# Altium schematic sheet ShutdownLoop.SchDoc: QUTMS Shutdown V2.1 - ShutdownLoop
size A4; Organization: QUT Motorsport; Address1: O-120; Address2: O Block; Address3: QUT Gardnes Point; Address4: Brisbane, 4000; DocumentNumber: 2; Revision: 9; SheetNumber: 2; SheetTotal: 7
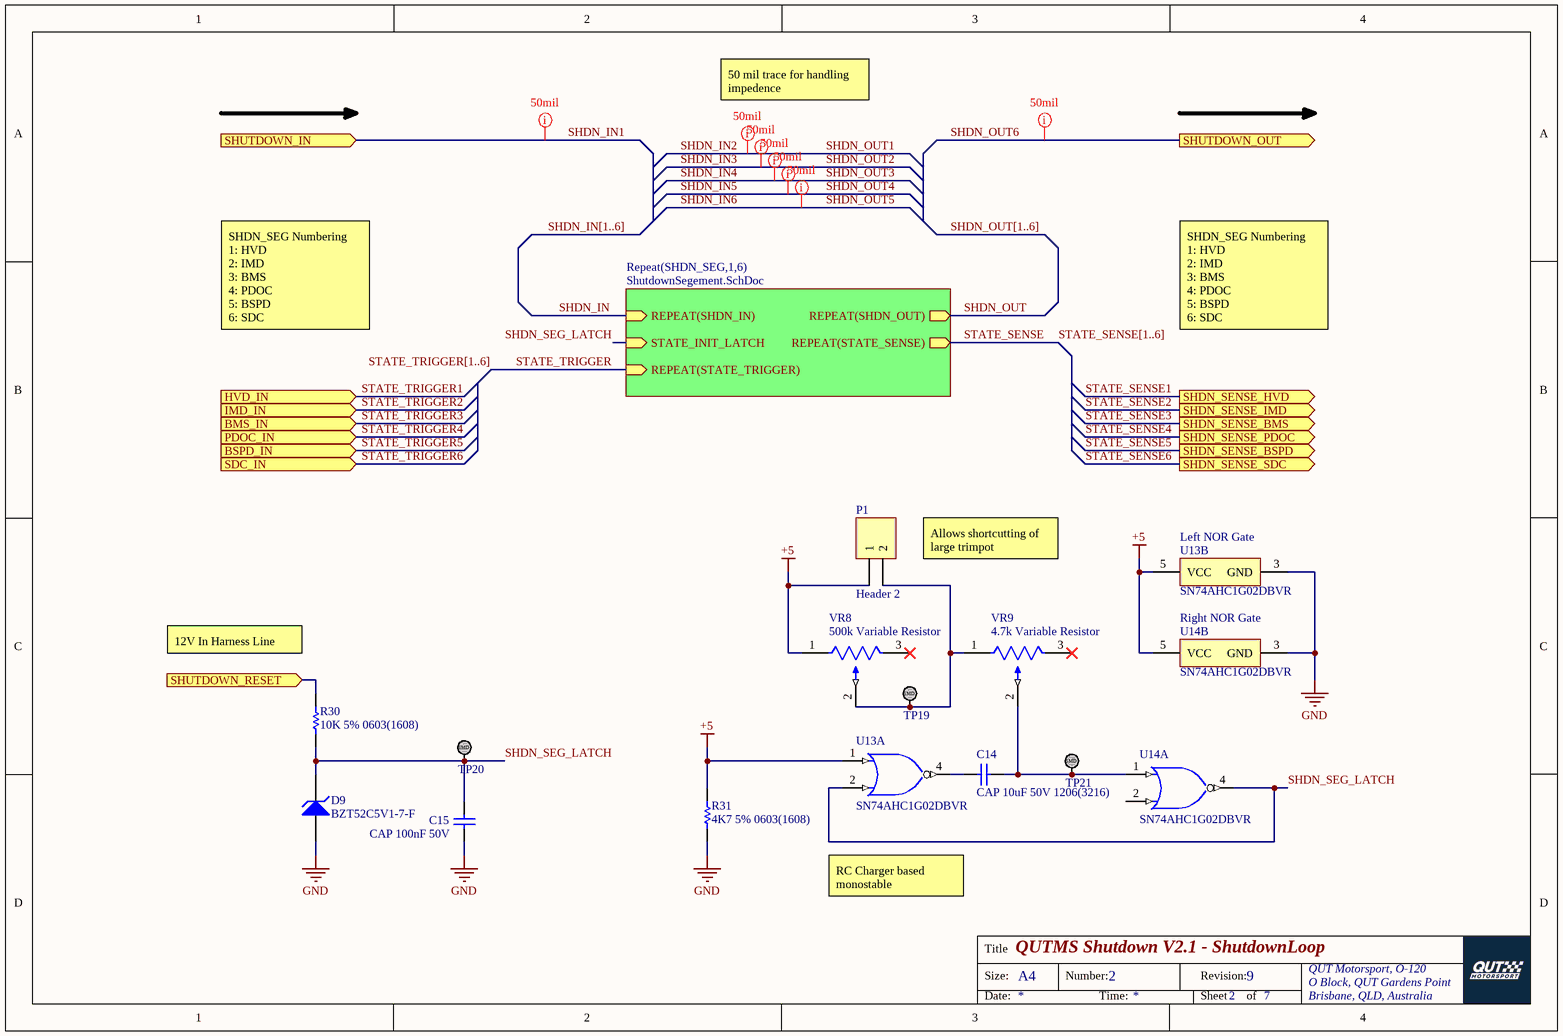
[diagram p0: ShutdownLoop.SchDoc]

## Parts
C14  CAP 10uF 50V 1206(3216)  [CAPC1206(3216)190_M]
C15  CAP 100nF 50V  [CAPC0603(1608)100_L]
D9  BZT52C5V1-7-F  [DIOD-SOD123_V]
P1  Header 2  [HDR1X2]
R30  10K 5% 0603(1608)  [RESC0603(1608)_N]
R31  4K7 5% 0603(1608)  [RESC0603(1608)_N]
TP19  TestPoint_SMD  [TestPointSMD]  (value not drawn)
TP20  TestPoint_SMD  [TestPointSMD]  (value not drawn)
TP21  TestPoint_SMD  [TestPointSMD]  (value not drawn)
U13  SN74AHC1G02DBVR  [DBV0005A_L]  (parts A,B of 2)
U14  SN74AHC1G02DBVR  [DBV0005A_L]  (parts A,B of 2)
VR8  500k Variable Resistor  [VG039NCHXTB472]
VR9  4.7k Variable Resistor  [VG039NCHXTB472]

## Sub-sheets
Repeat(SHDN_SEG,1,6) = ShutdownSegement.SchDoc: REPEAT(SHDN_OUT) (out), REPEAT(SHDN_IN) (in), STATE_INIT_LATCH (in), REPEAT(STATE_TRIGGER) (in), REPEAT(STATE_SENSE) (out)

## Ports
BMS_IN (in), BSPD_IN (in), HVD_IN (in), IMD_IN (in), PDOC_IN (in), SDC_IN (in), SHDN_SENSE_BMS (out), SHDN_SENSE_BSPD (out), SHDN_SENSE_HVD (out), SHDN_SENSE_IMD (out), SHDN_SENSE_PDOC (out), SHDN_SENSE_SDC (out), SHUTDOWN_IN (in), SHUTDOWN_OUT (out), SHUTDOWN_RESET (in)

## Nets
+5: P1.1 R31.2 U13.1(A) U13.5(VCC) U14.5(VCC) VR8.1
GND: C15.2 D9.1(A) R31.1 U13.3(GND) U14.3(GND)
SHDN_IN: sheet Repeat(SHDN_SEG,1,6)/REPEAT(SHDN_IN)
SHDN_IN1: port SHUTDOWN_IN
SHDN_OUT: sheet Repeat(SHDN_SEG,1,6)/REPEAT(SHDN_OUT)
SHDN_OUT6: port SHUTDOWN_OUT
SHDN_SEG_LATCH: C15.1 D9.2(K) R30.2 TP20.1 U13.2(B) U14.4(Y) ; sheet Repeat(SHDN_SEG,1,6)/STATE_INIT_LATCH
SHUTDOWN_RESET: R30.1 ; port SHUTDOWN_RESET
STATE_SENSE: sheet Repeat(SHDN_SEG,1,6)/REPEAT(STATE_SENSE)
STATE_SENSE1: port SHDN_SENSE_HVD
STATE_SENSE2: port SHDN_SENSE_IMD
STATE_SENSE3: port SHDN_SENSE_BMS
STATE_SENSE4: port SHDN_SENSE_PDOC
STATE_SENSE5: port SHDN_SENSE_BSPD
STATE_SENSE6: port SHDN_SENSE_SDC
STATE_TRIGGER: sheet Repeat(SHDN_SEG,1,6)/REPEAT(STATE_TRIGGER)
STATE_TRIGGER1: port HVD_IN
STATE_TRIGGER2: port IMD_IN
STATE_TRIGGER3: port BMS_IN
STATE_TRIGGER4: port PDOC_IN
STATE_TRIGGER5: port BSPD_IN
STATE_TRIGGER6: port SDC_IN
NetC14_1: C14.1 TP21.1 U14.1(A) VR9.2
NetC14_2: C14.2 U13.4(Y)
NetP1_2: P1.2 TP19.1 VR8.2 VR9.1

Not connected (* = marked no-connect by the designer): U14 2(B); VR8 3(49)*; VR9 3(49)*

## Buses and harness runs
bus SHDN_IN[1..6]
bus SHDN_OUT[1..6]
bus STATE_SENSE[1..6]
bus STATE_TRIGGER[1..6]

## Layout directives
rule Width Constraint [Pref Width = 50mil    Min Width = 50mil    Max Width = 50mil]: SHDN_IN1, SHDN_IN2, SHDN_IN3, SHDN_IN4, SHDN_IN5, SHDN_IN6, SHDN_OUT6

## Notes on the sheet
- 50 mil trace for handling impedence
- SHDN_SEG Numbering
  1: HVD
  2: IMD
  3: BMS
  4: PDOC
  5: BSPD
  6: SDC
- (near P1) Allows shortcutting of large trimpot
- (near U13) Left NOR Gate
- 12V In Harness Line
- Right NOR Gate
- RC Charger based monostable
- Title
- Size:
- A4
- Number:
- Revision:
- QUT Motorsport, O-120
- O Block, QUT Gardens Point
- Date:
- Time:
- Sheet
- of
- Brisbane, QLD, Australia
- (in symbol TestPoint_SMD) SMD

## Library data of the parts
C14 = CMP-1037-04982-1: CAP 10uF 50V ±10% 1206 (3216 Metric) Thickness 1.9mm SMD; Case-EIA: 1206; Tolerance: Â±10%; Case-Metric: 3216; Technology: SMT; Max Thickness: 1.9 mm; Value: 10uF; Rated Voltage: 50 V
C15 = CMP-1035-02591-1: CAP 100nF 50V ±5% 0603 (1608 Metric) Thickness 1mm SMD; Tolerance: Â±5%; Case-Metric: 1608; Case-EIA: 0603; Rated Voltage: 50 V; Max Thickness: 1 mm; Technology: SMT; Value: 100nF
D9 = CMP-2000-05976-1: Surface Mount Zener Diode, 5.1 V, -65 to 150 degC, 2-Pin SMD (SOD-123), RoHS, Tape and Reel; Manufacturer: DiodesIncorporated; Unit Weight: 0.000353oz; Zz - Zener Impedance: 60Ohms; Vz - Zener Voltage: 5.1V; Pd - Power Dissipation: 500mW; Zener Current: 5mA; Ir - Reverse Current: 2uA; Voltage Temperature Coefficient: -0.75mV/C; Configuration: Single; Voltage Tolerance: 6%; Height: 1.35mm; Width: 1.7mm; Minimum Operating Temperature: -65C; Series: BZT52C5; Package Description: 2-Pin Surface Mount Device, Body 2.7 x 1.55 mm; Length: 2.85mm; Mounting Technology: SurfaceMount; Brand: DiodesIncorporated; Factory Pack Quantity: 3000; Product Category: ZenerDiodes; RoHS: True; Manufacturer URL: http://www.diodes.com/; Termination Style: SMD/SMT; Package / Case: SOD-123; Packaging: Reel; Package Reference: SOD123; Datasheet Version: Rev. 37-2, 09/2012; Maximum Operating Temperature: +150C; Datasheet URL: http://www.diodes.com/_files/datasheets/ds18004.pdf; Mounting Style: SMD/SMT
P1 = Header 2: Header, 2-Pin; LatestRevisionDate: 17-Jul-2002; LatestRevisionNote: Re-released for DXP Platform.; Publisher: Altium Limited
R30 = CMP-1012-00098-1: 10K 0.1W 5% 0603 (1608 Metric)  SMD; Case-EIA: 0603; Value: 10000.00 Ohm; Case-Metric: 1608; Technology: SMT; Tolerance: 5 %; Power: 0.1 W
R31 = CMP-1012-00090-1: 4K7 0.1W 5% 0603 (1608 Metric)  SMD; Case-Metric: 1608; Value: 4700.00 Ohm; Case-EIA: 0603; Tolerance: 5 %; Technology: SMT; Power: 0.1 W
U13 U14 = CMP-0859-00024-3: Single 2-Input Positive-NOR Gate, DBV0005A, LARGE T&R; Manufacturer: Texas Instruments; Output Drive (IOL/IOH)(Max)(mA): 50/-50; Sub-Family: NAND Gate; Gate Type: NOR; Output Type: CMOS; 3-State Output: No; Voltage(Nom)(V): 3.3,5; tpd @ Nom Voltage(Max)(ns): 11.4,7.5; Bits(#): 1; VCC(Max)(V): 5.5; ICC @ Nom Voltage(Max)(mA): 0.01; VCC(Min)(V): 2; Technology Family: AHC; Rating: Catalog; Logic: True; F @ Nom Voltage(Max)(Mhz): 75; DatasheetVersion: SCLS342M; Input Type: CMOS; Operating Temperature Range(C): -40 to 125,-40 to 85; Generic Part Number: SN74AHC1G02; PackageReference: DBV0005A; Schmitt Trigger: No
VR8 = 500k Variable Resistor: 500K ±25% ±250 ppm/°C SMD Variable Resistors RoHS | VG039NCHXTB504; ComponentLink1Description: LCSC; ComponentLink1URL: https://lcsc.com/product-detail/Variable-Resistors_HDK-Hokuriku-Elec-Industry-VG039NCHXTB504_C128558.html
VR9 = 4.7k Variable Resistor: 4k7 ±25% ±250 ppm/°C SMD Variable Resistors RoHS | VG039NCHXTB472; ComponentLink1Description: LCSC; ComponentLink1URL: https://lcsc.com/product-detail/Variable-Resistors_HDK-Hokuriku-Elec-Industry-VG039NCHXTB472_C128555.html